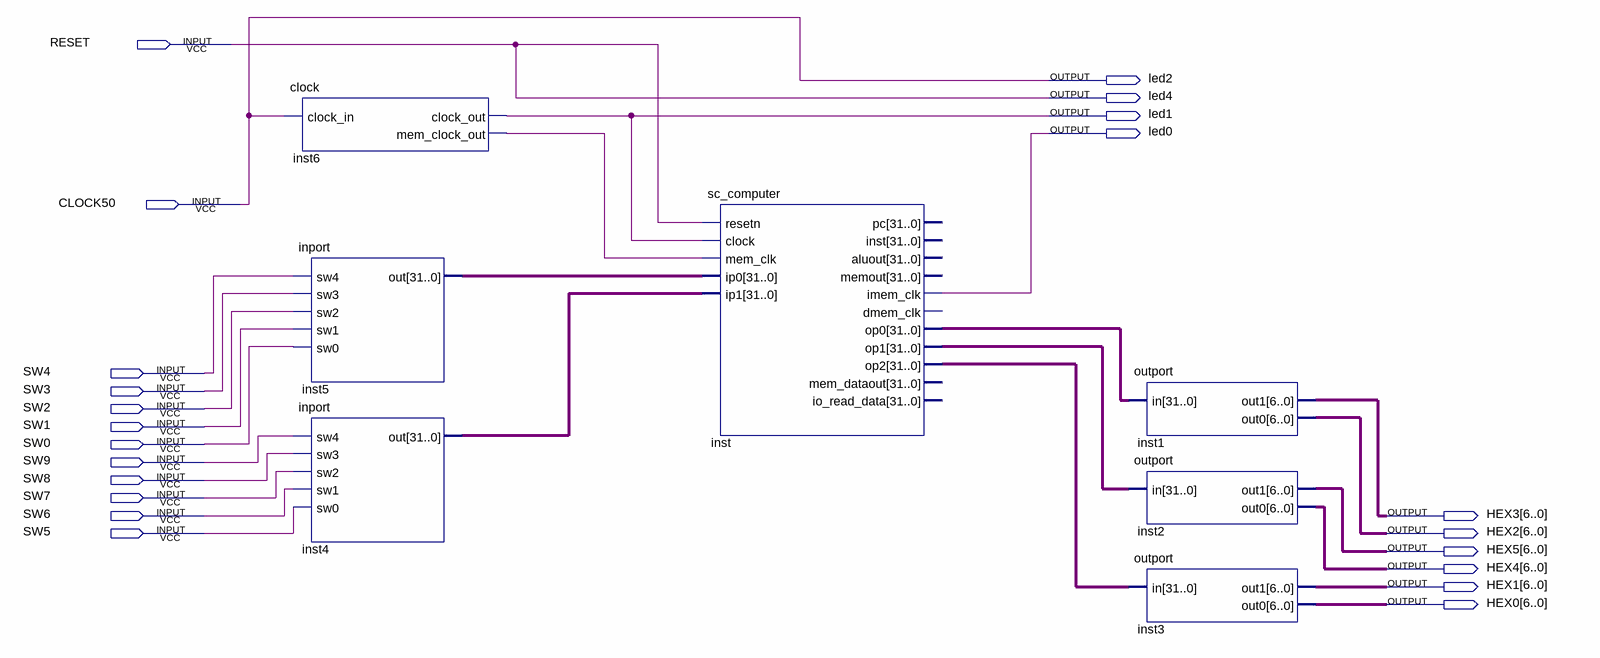
[diagram p0: schematic sheet]
// Quartus schematic computer.bdf as structural Verilog: 7 symbols, 22 pins
module computer (
  input  RESET,
  input  CLOCK50,
  input  SW4,
  input  SW3,
  input  SW2,
  input  SW1,
  input  SW0,
  input  SW9,
  input  SW8,
  input  SW7,
  input  SW6,
  input  SW5,
  output led2,
  output led4,
  output led1,
  output led0,
  output [6:0] HEX3,
  output [6:0] HEX2,
  output [6:0] HEX5,
  output [6:0] HEX4,
  output [6:0] HEX1,
  output [6:0] HEX0
);

  wire inst6_mem_clock_out;
  wire [31:0] inst4_out, inst5_out, inst_op0, inst_op1, inst_op2;

  clock inst6 (.clock_in(CLOCK50), .clock_out(led1), .mem_clock_out(inst6_mem_clock_out));
  inport inst5 (.sw4(SW4), .sw3(SW3), .sw2(SW2), .sw1(SW1), .sw0(SW0), .out(inst5_out));
  inport inst4 (.sw4(SW9), .sw3(SW8), .sw2(SW7), .sw1(SW6), .sw0(SW5), .out(inst4_out));
  sc_computer inst (
    .resetn(RESET), .clock(led1), .mem_clk(inst6_mem_clock_out), .ip0(inst5_out), .ip1(inst4_out),
    .imem_clk(led0), .op0(inst_op0), .op1(inst_op1), .op2(inst_op2));  // open: pc, inst, aluout, memout, dmem_clk, mem_dataout, io_read_data
  outport inst1 (.in(inst_op0), .out1(HEX3), .out0(HEX2));
  outport inst2 (.in(inst_op1), .out1(HEX5), .out0(HEX4));
  outport inst3 (.in(inst_op2), .out1(HEX1), .out0(HEX0));

  assign led2 = CLOCK50;
  assign led4 = RESET;
endmodule
